# EAGLE design GarageDoor (EAGLE 7.2.0)
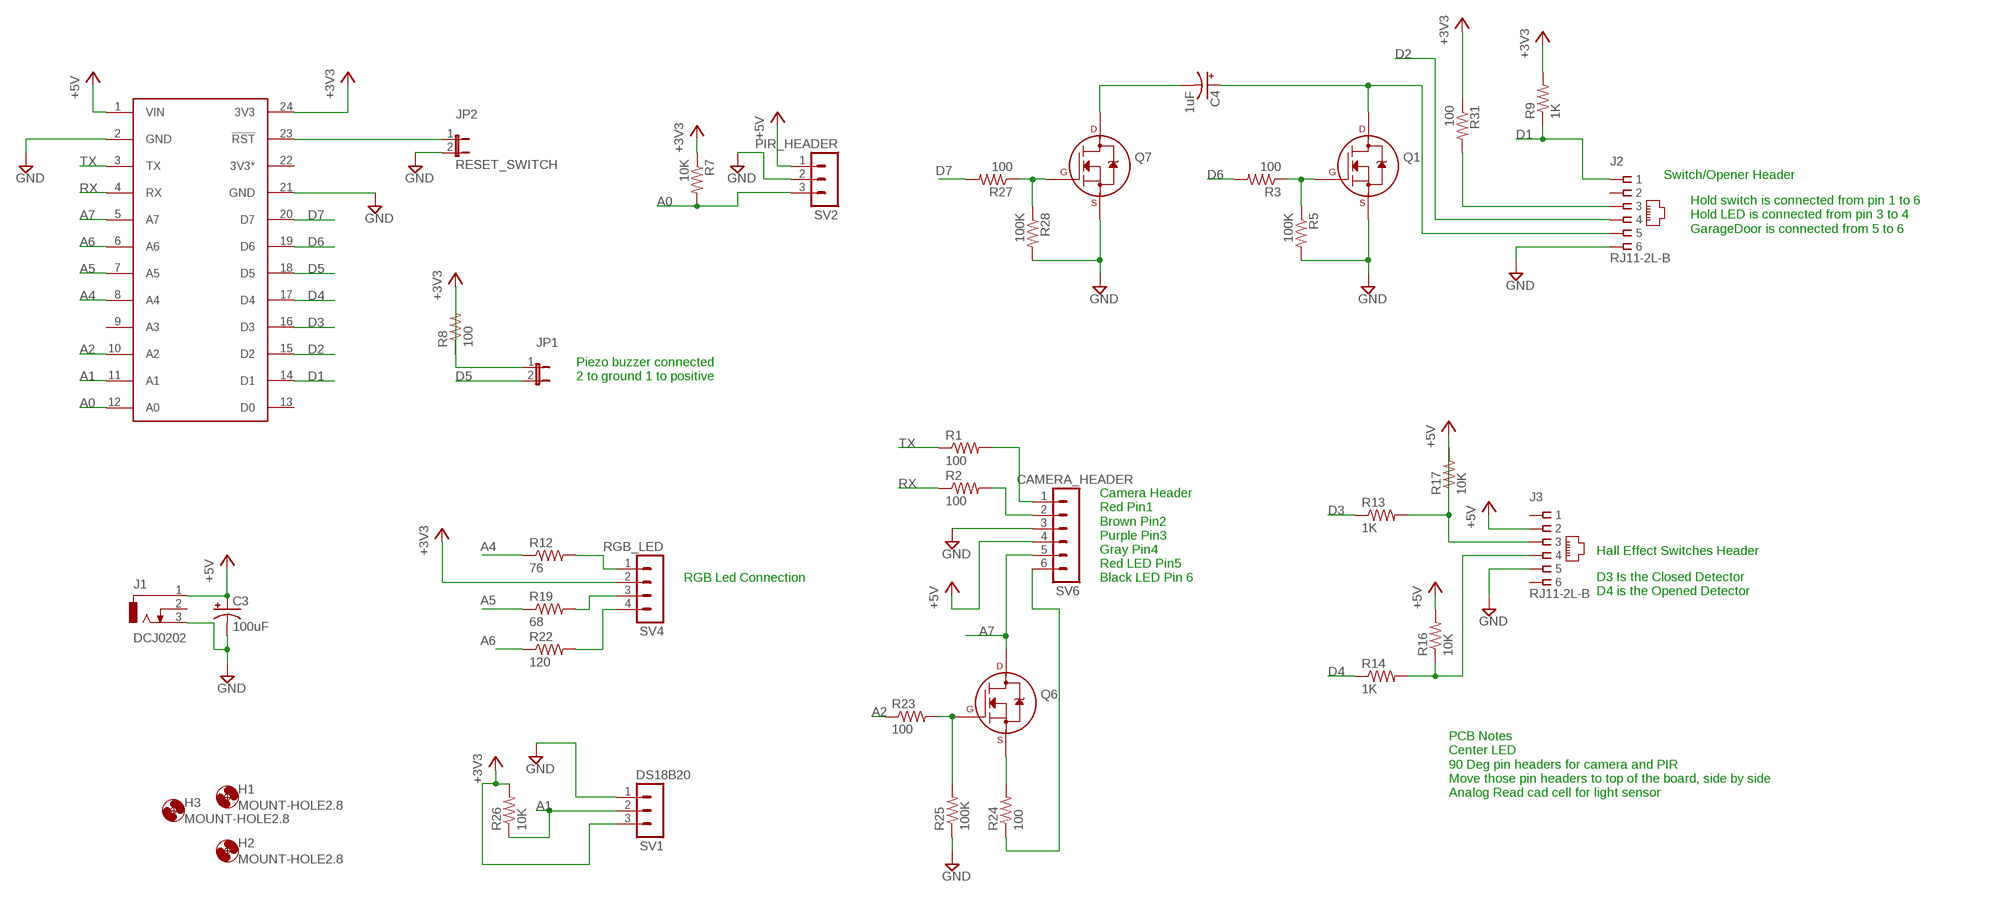
[diagram p0: schematic, sheet 1]

## Parts
C3  100uF  CPOL-USE2,5-6E  [E2,5-6E]
C4  1uF  CPOL-USE2,5-6E  [E2,5-6E]
H1  MOUNT-HOLE2.8  [2,8]
H2  MOUNT-HOLE2.8  [2,8]
H3  MOUNT-HOLE2.8  [2,8]
J1  DCJ0202  [DCJ0202]
J2  RJ11-2L-B  [RJ11-NO_SHIELD]
J3  RJ11-2L-B  [RJ11-NO_SHIELD]
JP1  JP1E  [JP1]
JP2  RESET_SWITCH  JP1E  [JP1]
Q1  2N7000_SOT23  [SOT-23]
Q6  2N7000_SOT23  [SOT-23]
Q7  2N7000_SOT23  [SOT-23]
R1  100  R-US_R0805  [R0805]
R2  100  R-US_R0805  [R0805]
R3  100  R-US_R0805  [R0805]
R5  100K  R-US_R0805  [R0805]
R7  10K  R-US_R0805  [R0805]
R8  100  R-US_R0805  [R0805]
R9  1K  R-US_R0805  [R0805]
R12  76  R-US_R0805  [R0805]
R13  1K  R-US_R0805  [R0805]
R14  1K  R-US_R0805  [R0805]
R16  10K  R-US_R0805  [R0805]
R17  10K  R-US_R0805  [R0805]
R19  68  R-US_R0805  [R0805]
R22  120  R-US_R0805  [R0805]
R23  100  R-US_R0805  [R0805]
R24  100  R-US_R0805  [R0805]
R25  100K  R-US_R0805  [R0805]
R26  10K  R-US_R0805  [R0805]
R27  100  R-US_R0805  [R0805]
R28  100K  R-US_R0805  [R0805]
R31  100  R-US_R0805  [R0805]
SC1  SPARK_CORECORE  [SPARK_CORE]
SV1  DS18B20  MA03-1  [MA03-1]
SV2  PIR_HEADER  MA03-1  [MA03-1]
SV4  RGB_LED  MA04-1  [MA04-1]
SV6  CAMERA_HEADER  MA06-1  [MA06-1]

## Nets
+3V3: R7.1 R8.1 R9.2 R26.2 R31.1 SC1.24(3V3) SV1.3 SV4.2
+5V: C3.+ J1.1 J3.2 R16.2 R17.1 SC1.1(VIN) SV2.1 SV6.4
A0: R7.2 SC1.12(A0) SV2.3
A1: R26.1 SC1.11(A1) SV1.2
A2: R23.1 SC1.10(A2)
A4: R12.1 SC1.8(A4)
A5: R19.1 SC1.7(A5)
A6: R22.1 SC1.6(A6)
A7: Q6.3(D) SC1.5(A7) SV6.5
D1: J2.1 R9.1 SC1.14(D1)
D2: J2.4 SC1.15(D2)
D3: R13.1 SC1.16(D3)
D4: R14.1 SC1.17(D4)
D5: JP1.2 SC1.18(D5)
D6: R3.2 SC1.19(D6)
D7: R27.2 SC1.20(D7)
GND: C3.- J1.3 J2.6 J3.5 JP2.2 Q1.2(S) Q7.2(S) R5.2 R25.1 R28.2 SC1.2(GND) SC1.21(GND) SV1.1 SV2.2 SV6.3
N$1: Q1.1(G) R3.1 R5.1
N$2: R22.2 SV4.4
N$3: R12.2 SV4.1
N$4: R19.2 SV4.3
N$5: Q7.1(G) R27.1 R28.1
N$13: J3.3 R13.2 R17.2
N$15: J3.4 R14.2 R16.1
N$16: C4.+ J2.5 Q1.3(D)
N$18: JP1.1 R8.2
N$19: R1.2 SV6.1
N$20: R2.2 SV6.2
N$22: Q6.2(S) R24.2
N$23: R24.1 SV6.6
N$24: Q6.1(G) R23.2 R25.2
N$26: JP2.1 SC1.23(!RST)
N$29: C4.- Q7.3(D)
N$31: J2.3 R31.2
RX: R2.1 SC1.4(RX)
TX: R1.1 SC1.3(TX)
Unconnected: J1.2 J2.2 J3.1 J3.6 SC1.9(A3) SC1.13(D0)

## Notes on the sheet
- Switch/Opener Header
- Hold switch is connected from pin 1 to 6
  Hold LED is connected from pin 3 to 4
  GarageDoor is connected from 5 to 6
- Piezo buzzer connected
  2 to ground 1 to positive
- Hall Effect Switches Header
- RGB Led Connection
- Camera Header
  Red Pin1
  Brown Pin2
  Purple Pin3
  Gray Pin4
  Red LED Pin5
  Black LED Pin 6
- D3 Is the Closed Detector
  D4 is the Opened Detector
- PCB Notes
  Center LED
  90 Deg pin headers for camera and PIR
  Move those pin headers to top of the board, side by side
  Analog Read cad cell for light sensor

## Power pins joined to a net without a drawn wire
3V3*: SC1.22(3V3*)

## Library data of the parts
C3 C4 = rcl:CPOL-US: POLARIZED CAPACITOR, American symbol
H1-H3 = holes:MOUNT-HOLE: MOUNTING HOLE with drill center marker
J1 = con-jack:DCJ0202: DC POWER JACK Source: DCJ0202.pdf; OC_FARNELL: unknown; OC_NEWARK: unknown
J2 J3 = KevinsLib:RJ11: CORCOM Modular RJ Jacks No Shield Source: www.tycoelectronics.com .. ENG_DS_1654001_1099_RJ_L_0507.pdf; MF: TYCO ELECTRONICS; MPN: RJ11-2L-B; OC_FARNELL: unknown; OC_NEWARK: 83F4463
JP1 JP2 = jumper:JP1E: JUMPER
Q1 Q6 Q7 = transistors:2N700*: 2N7000, 2N7002, NDS7002A N-channel enhancement mode MOSFET
R1-R3 R5 R7-R9 R12-R14 R16 R17 R19 R22-R28 R31 = resistor:R-US_: RESISTOR, American symbol
SC1 = Spark:SPARK_CORE
SV1 SV2 = con-lstb:MA03-1: PIN HEADER; OC_FARNELL: unknown; OC_NEWARK: unknown
SV4 = con-lstb:MA04-1: PIN HEADER; OC_FARNELL: unknown; OC_NEWARK: unknown
SV6 = con-lstb:MA06-1: PIN HEADER; OC_FARNELL: unknown; OC_NEWARK: unknown

## Board
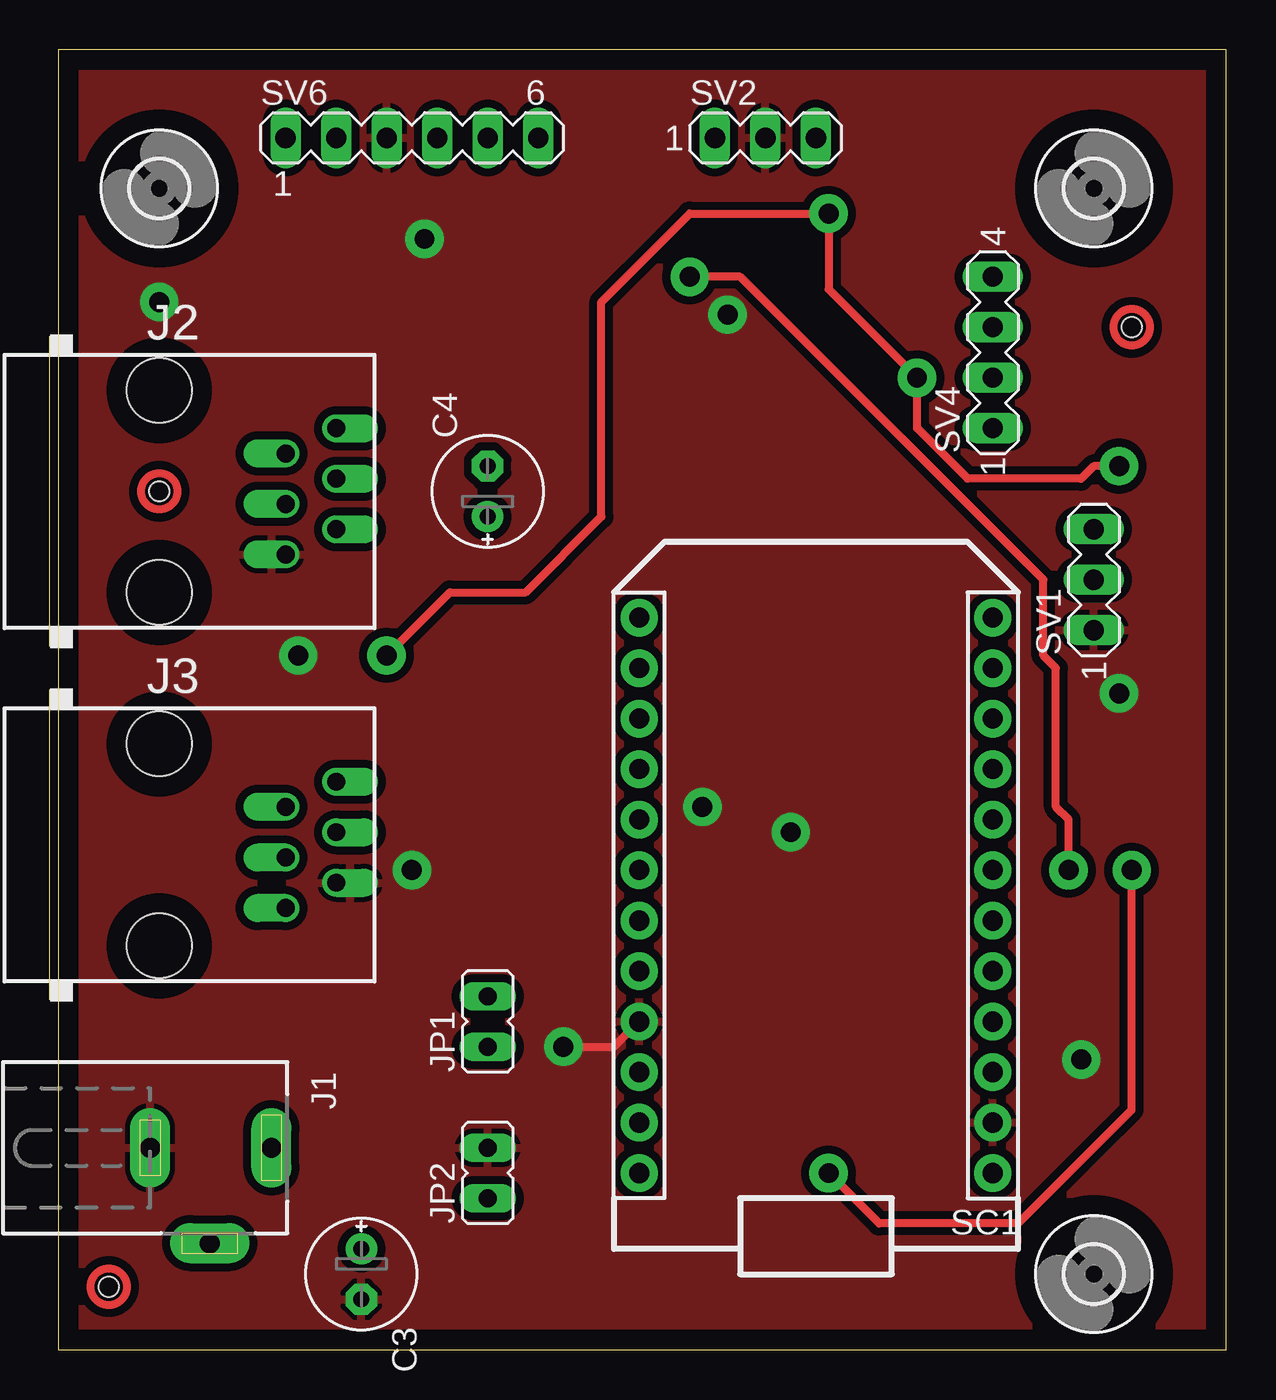
[diagram p1: board, top side]
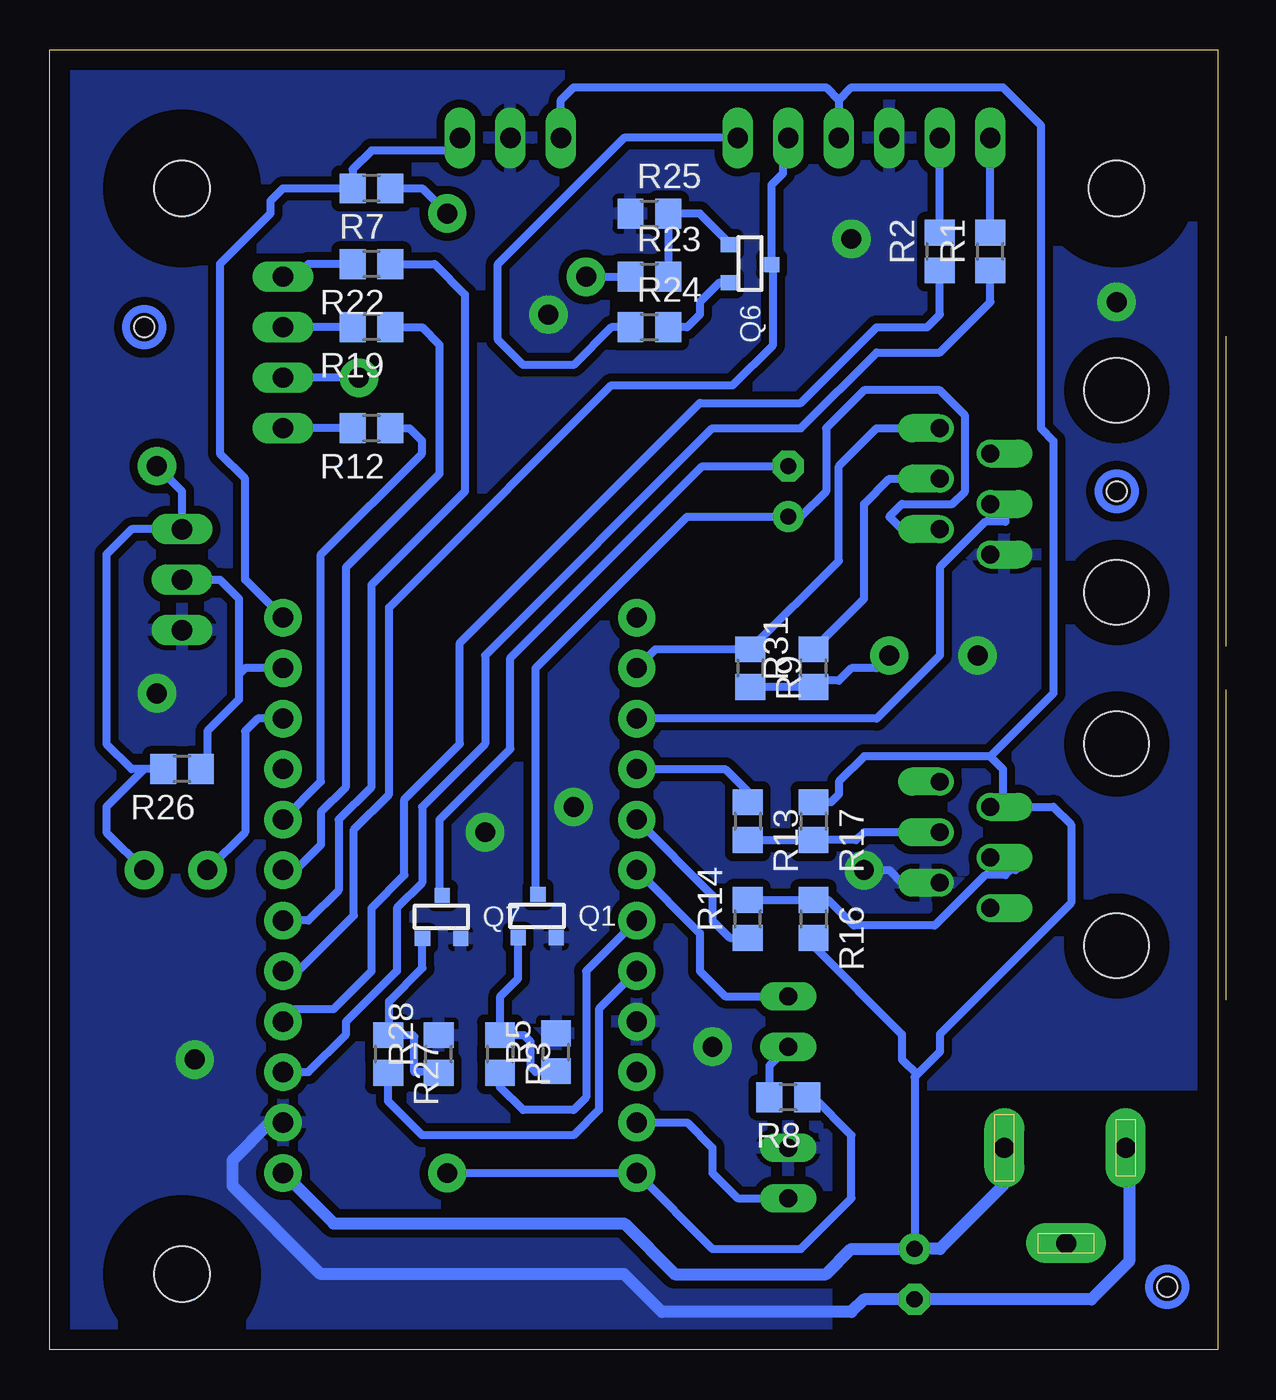
[diagram p2: board, bottom side, seen from below]

Size 58.73 x 65.39 mm. Coordinates in mm from the lower left corner, seen from the top.
Outline: 0,0 58.73,0 58.73,65.39 0,65.39 0,0
Copper layers (1*16): Top 0.035mm / dielectric 1.5mm / Bottom 0.035mm
Design rules "default *": minimum track width 10mil, minimum drill 24mil, track to track 8mil, track to pad 8mil, pad to pad 8mil, via to via 8mil, smd to smd 8mil, copper to edge 40mil, drill to drill 8mil, minimum pad ring 10mil, minimum via ring 8mil, stop-mask expansion 4mil, vias tented up to drill 0mil, thermal gap 10mil
Holes 1 mm at 53.98,51.44 2.54,3.17 5.08,43.18

### Footprints (pad centres in the part's own frame; a part is rotated, then mirrored left to right if it is on the bottom)
E2,5-6E = drill 0.813 pad 1.575: + -1.27,0 | drill 0.813 pad 1.575 octagon: - 1.27,0
2,8 = hole 2.8: 0,0
DCJ0202 = drill 1 pad 2 long: 1 0,3.1; 2 4.8,0; 3 0,-3
RJ11-NO_SHIELD = drill 0.9 pad 1.4 offset: 1 -3.175,8.89; 2 -1.905,6.35; 3 -0.635,8.89; 4 0.635,6.35; 5 1.905,8.89; 6 3.175,6.35 | hole 3.251: -5.08,0; 5.08,0
JP1 = drill 0.914 long: 1 0,-1.27; 2 0,1.27
SOT-23 = smd 0.762 x 0.762: 1 -0.979,-1.101; 2 0.94,-1.101; 3 0.025,1.067
R0805 = smd 1.3 x 1.5: 1 -0.95,0; 2 0.95,0
SPARK_CORE = drill 1.016 pad 1.88: 1 -8.89,13.97; 2 -8.89,11.43; 3 -8.89,8.89; 4 -8.89,6.35; 5 -8.89,3.81; 6 -8.89,1.27; 7 -8.89,-1.27; 8 -8.89,-3.81; 9 -8.89,-6.35; 10 -8.89,-8.89; 11 -8.89,-11.43; 12 -8.89,-13.97; 13 8.89,-13.97; 14 8.89,-11.43; 15 8.89,-8.89; 16 8.89,-6.35; 17 8.89,-3.81; 18 8.89,-1.27; 19 8.89,1.27; 20 8.89,3.81; 21 8.89,6.35; 22 8.89,8.89; 23 8.89,11.43; 24 8.89,13.97
MA03-1 = drill 1.016 long: 1 -2.54,0; 2 0,0; 3 2.54,0
MA04-1 = drill 1.016 long: 1 -3.81,0; 2 -1.27,0; 3 1.27,0; 4 3.81,0
MA06-1 = drill 1.016 long: 1 -6.35,0; 2 -3.81,0; 3 -1.27,0; 4 1.27,0; 5 3.81,0; 6 6.35,0

### Placement (x,y rotation side)
C3  15.24,3.81 270 top
C4  21.59,43.18 90 top
H1  5.08,58.42 0 top
H2  52.07,3.81 0 top
H3  52.07,58.42 0 top
J1  7.62,10.16 270 top
J2  5.08,43.18 270 top
J3  5.08,25.4 270 top
JP1  21.59,16.51 0 top
JP2  21.59,8.89 0 top
Q1  34.2,21.84 0 bottom
Q6  23.5,54.61 270 bottom
Q7  39.01,21.79 0 bottom
R1  11.43,55.24 90 bottom
R2  13.97,55.24 90 bottom
R3  36.09,14.88 270 bottom
R5  33.27,14.97 90 bottom
R7  42.55,58.42 180 bottom
R8  21.59,12.7 180 bottom
R9  23.5,34.29 270 bottom
R12  42.55,46.35 180 bottom
R13  23.63,26.59 270 bottom
R14  23.63,21.67 90 bottom
R16  20.32,21.67 270 bottom
R17  20.32,26.59 270 bottom
R19  42.55,51.44 180 bottom
R22  42.55,54.61 180 bottom
R23  28.57,53.98 0 bottom
R24  28.57,51.44 0 bottom
R25  28.57,57.15 0 bottom
R26  52.07,29.21 180 bottom
R27  41.71,14.88 270 bottom
R28  39.17,14.88 90 bottom
R31  20.32,34.29 90 bottom
SC1  38.1,22.86 180 top
SV1  52.07,38.73 90 top
SV2  35.56,60.96 0 top
SV4  46.99,50.16 90 top
SV6  17.78,60.96 0 top

### Tracks (layer width: path | path; a pad name or v marks a point on that pad's centre or on a via)
+3V3  (via drill 1 pad 1.93)
  Top 0.406: v38.73,8.89 41.27,6.35 48.26,6.35 53.98,12.06 v53.98,24.13 | v53.34,44.45 52.07,44.45 51.44,43.81 45.72,43.81 43.18,46.35 v43.18,48.9 38.73,53.34 38.73,56.52 | v38.73,57.15 38.73,56.52 | 38.73,56.52 38.1,57.15 31.75,57.15 27.3,52.7 27.3,41.91 23.5,38.1 19.68,38.1 v16.51,34.92
  Bottom 0.406: R8.1 20.32,12.7 18.41,10.79 18.41,7.62 20.95,5.08 25.4,5.08 SC1.24 v38.73,8.89 | v53.98,24.13 55.88,26.04 55.88,27.3 53.98,29.21 R26.2 54.61,29.21 55.88,30.48 55.88,40.01 54.61,41.27 SV1.3 52.07,43.18 v53.34,44.45 | v43.18,48.9 SV4.2 | R7.1 40.01,58.42 v38.73,57.15 | R9.2 R31.1 20,33.66 19.05,33.66 18.41,34.29 17.14,34.29 v16.51,34.92
+5V
  Bottom 0.406: 10.16,27.3 8.26,27.3 7.37,26.42 7.37,22.48 13.97,15.88 13.97,14.99 15.11,13.84 | J3.2 10.16,27.3 | 10.16,27.3 10.79,27.94 10.79,29.21 11.43,29.84 | 11.43,29.84 17.78,29.84 19.05,28.57 19.05,27.94 19.45,27.54 R17.1 | 19.05,62.87 18.41,63.5 10.79,63.5 8.89,61.59 8.89,46.35 8.26,45.72 8.26,33.02 11.43,29.84 | SV2.1 33.02,62.87 32.38,63.5 19.68,63.5 19.05,62.87 | 19.05,62.87 SV6.4 | 15.11,13.84 15.24,13.72 C3.+ | R16.2 20.32,20.32 15.88,15.88 15.88,14.61 15.11,13.84
  Bottom 0.61: SC1.1 44.45,6.35 29.84,6.35 27.3,3.81 19.68,3.81 18.41,5.08 C3.+ 13.97,5.08 10.79,8.26 10.79,10.09 J1.1
A0
  Bottom 0.406: SC1.12 48.9,38.73 48.9,43.81 50.16,45.09 50.16,54.61 47.62,57.15 47.62,57.78 46.99,58.42 R7.2 43.49,59.38 42.55,60.33 38.73,60.33 SV2.3
A1
  Bottom 0.406: SC1.11 48.9,34.29 49.21,33.97 | SV1.2 50.16,38.73 49.21,37.78 49.21,33.97 | 49.21,33.97 49.21,32.7 50.8,31.11 50.8,29.53 R26.1
A2  (via drill 1 pad 1.93)
  Top 0.406: v50.8,24.13 50.8,26.67 50.16,27.3 50.16,34.29 49.53,34.92 49.53,38.73 34.29,53.98 v31.75,53.98
  Bottom 0.406: SC1.10 48.26,31.75 48.9,31.11 48.9,26.04 v50.8,24.13 | v31.75,53.98 R23.1
A4
  Bottom 0.406: R12.1 40.64,46.35 40.01,45.72 40.01,45.09 45.09,40.01 45.09,28.57 SC1.8
A5
  Bottom 0.406: R19.1 40.01,51.44 39.12,50.55 39.12,44.07 43.81,39.37 43.81,28.32 45.09,27.05 45.09,25.4 46.35,24.13 SC1.7
A6
  Bottom 0.406: R22.1 39.37,54.61 37.85,53.09 37.85,43.18 42.55,38.48 42.55,28.32 44.2,26.67 44.2,23.11 45.72,21.59 SC1.6
A7
  Bottom 0.406: SC1.5 46.23,19.05 43.43,21.84 43.43,26.16 41.66,27.94 41.66,37.34 40.89,38.1 40.77,38.23 30.48,48.51 24.38,48.51 22.35,50.55 22.35,54.51 Q6.3 22.43,58.6 21.84,59.18 21.84,60.71 SV6.5
D1
  Bottom 0.406: SC1.14 28.26,35.24 R9.1 19.05,39.69 19.05,44.45 17.14,46.35 J2.1
D2
  Bottom 0.406: J2.4 11.3,42.55 10.67,41.91 10.67,41.66 11.68,41.66 13.97,39.37 13.97,34.92 17.14,31.75 SC1.15
D3
  Bottom 0.406: SC1.16 24.77,29.21 23.63,28.07 R13.1
D4
  Bottom 0.406: SC1.17 25.4,22.86 25.4,21.59 24.53,20.72 R14.1
D5
  Bottom 0.406: SC1.18 26.04,20.95 26.04,19.05 24.77,17.78 JP1.2
D6
  Bottom 0.406: SC1.19 31.75,19.05 31.75,12.7 32.38,12.06 34.92,12.06 36.09,13.22 R3.2
D7
  Bottom 0.406: SC1.20 31.11,17.14 31.11,12.06 32.38,10.79 40.01,10.79 41.71,12.5 R27.2
GND  (via drill 1 pad 1.93)
  Top 0.406: v25.4,15.24 27.94,15.24 SC1.21
  Bottom 0.406: v17.78,24.13 16.51,24.13 15.88,23.5 15.24,23.5
  Bottom 0.61: J1.3 4.45,9.98 4.45,4.45 6.35,2.54 C3.- 17.78,2.54 18.41,1.91 27.94,1.91 29.84,3.81 45.09,3.81 49.53,8.26 49.53,9.53 47.62,11.43 SC1.2
  other vias: 51.44,14.61 18.41,55.88 33.66,52.07 32.38,27.3 36.83,26.04 12.06,34.92 5.08,52.7 53.34,33.02
  pour Bottom (isolate 0.406): 0,13.34 19.68,13.34 19.68,0 58.42,0 58.42,65.41 0,65.41
  pour Top (isolate 0.406): 0,65.41 0,0 58.42,0 59.05,0 59.05,65.41
N$1
  Bottom 0.406: Q1.1 35.17,18.67 36.07,17.78 36.07,15.84 R3.1 34.88,15.82 34.54,15.49 34.54,14.22 34.29,13.97 33.31,13.97 R5.1
N$2
  Bottom 0.406: R22.2 45.72,54.61 46.35,53.98 SV4.4
N$3
  Bottom 0.406: R12.2 SV4.1
N$4
  Bottom 0.406: R19.2 SV4.3
N$5
  Bottom 0.406: Q7.1 39.98,19.2 41.66,17.53 41.66,15.88 R27.1 40.46,15.82 40.39,15.75 40.39,13.97 39.22,13.97 R28.1
N$13
  Bottom 0.406: J3.3 17.78,26.04 18.18,25.64 R17.2 R13.2
N$15
  Bottom 0.406: R14.2 R16.1 20.31,22.61 19.56,22.61 18.29,21.34 14.22,21.34 11.68,23.88 10.67,23.88 10.41,24.13 10.16,24.13 10.79,24.77 J3.4
N$16
  Bottom 0.406: Q1.3 34.29,23.02 34.29,34.29 26.67,41.91 C4.+ 20.95,41.91 19.68,43.18 19.68,46.35 17.78,48.26 13.97,48.26 12.7,46.99 12.7,43.18 13.34,42.55 15.88,42.55 16.51,41.91 15.88,41.27 J2.5
N$18
  Bottom 0.406: JP1.1 22.54,14.29 R8.2
N$19
  Bottom 0.406: R1.2 SV6.1
N$20
  Bottom 0.406: R2.2 SV6.2
N$22
  Bottom 0.406: Q6.2 25.07,53.67 26.04,52.7 26.04,52.07 26.67,51.44 R24.2
N$23
  Bottom 0.406: SV6.6 29.84,60.96 36.2,54.61 36.2,50.8 34.92,49.53 32.38,49.53 30.48,51.44 R24.1
N$24
  Bottom 0.406: R23.2 R25.2 26.04,57.15 24.6,55.71 Q6.1
N$26
  Bottom 0.406: SC1.23 26.67,11.43 25.4,10.16 25.4,8.89 24.13,7.62 JP2.1
N$29
  Bottom 0.406: Q7.3 39.12,22.99 39.12,26.67 35.56,30.23 35.56,34.8 25.91,44.45 C4.-
N$31
  Bottom 0.406: R31.2 17.78,37.78 17.78,42.55 16.51,43.81 J2.3
RX
  Bottom 0.406: SC1.4 46.35,17.14 44.45,17.14 42.55,19.05 42.55,22.23 40.89,23.88 40.89,27.69 38.1,30.48 38.1,35.56 26.04,47.62 20.95,47.62 17.14,51.44 14.61,51.44 13.97,52.07 R2.1
TX
  Bottom 0.406: SC1.3 45.72,13.97 43.81,15.88 43.81,16.51 41.27,19.05 41.27,22.23 40.01,23.5 40.01,27.3 36.83,30.48 36.83,34.92 25.4,46.35 20.95,46.35 17.14,50.16 13.97,50.16 11.43,52.7 R1.1
(copper drawn outside any net)
  shapes: Bottom circle x3, Top circle x3